# Altium schematic sheet MCU_Board_top.SchDoc
size A4; SheetNumber: 1; SheetTotal: 5
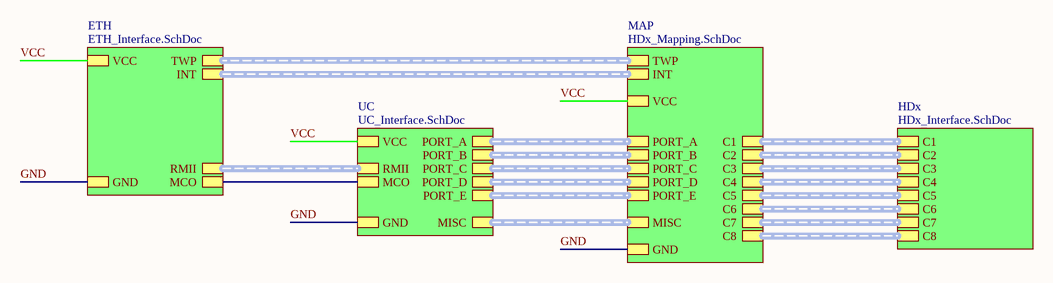
[diagram p0: MCU_Board_top.SchDoc]

## Sub-sheets
ETH = ETH_Interface.SchDoc: GND, VCC, INT (harness INTERFACE), RMII (harness RMII), MCO, TWP (harness TWP_INTERFACE)
HDx = HDx_Interface.SchDoc: C1 (harness C1), C2 (harness C2), C3 (harness C3), C4 (harness C4), C6 (harness C6), C5 (harness C5), C8 (harness C8), C7 (harness C7)
MAP = HDx_Mapping.SchDoc: C1 (harness C1), PORT_A (harness PORT_A), C2 (harness C2), C3 (harness C3), C4 (harness C4), C5 (harness C5), C6 (harness C6), C7 (harness C7), C8 (harness C8), PORT_B (harness PORT_B), PORT_C (harness PORT_C), PORT_D (harness PORT_D), PORT_E (harness PORT_E), MISC (harness MISC), GND, VCC, TWP (harness TWP_INTERFACE), INT (harness INTERFACE)
UC = UC_Interface.SchDoc: GND, VCC, RMII (harness RMII), MCO, PORT_A (harness PORT_A), PORT_B (harness PORT_B), PORT_C (harness PORT_C), PORT_D (harness PORT_D), PORT_E (harness PORT_E), MISC (harness MISC)

## Nets
GND: sheet ETH/GND, sheet UC/GND, sheet MAP/GND
VCC: sheet ETH/VCC, sheet UC/VCC, sheet MAP/VCC
(unnamed): sheet ETH/MCO, sheet UC/MCO

## Buses and harness runs
harness sheet ETH/INT = sheet MAP/INT
harness sheet ETH/RMII = sheet UC/RMII
harness sheet ETH/TWP = sheet MAP/TWP
harness sheet HDx/C1 = sheet MAP/C1
harness sheet HDx/C2 = sheet MAP/C2
harness sheet HDx/C3 = sheet MAP/C3
harness sheet HDx/C4 = sheet MAP/C4
harness sheet HDx/C5 = sheet MAP/C5
harness sheet HDx/C6 = sheet MAP/C6
harness sheet HDx/C7 = sheet MAP/C7
harness sheet HDx/C8 = sheet MAP/C8
harness sheet MAP/MISC = sheet UC/MISC
harness sheet MAP/PORT_A = sheet UC/PORT_A
harness sheet MAP/PORT_B = sheet UC/PORT_B
harness sheet MAP/PORT_C = sheet UC/PORT_C
harness sheet MAP/PORT_D = sheet UC/PORT_D
harness sheet MAP/PORT_E = sheet UC/PORT_E